# EAGLE design home_info_center_esp12f (EAGLE 8.7.1)
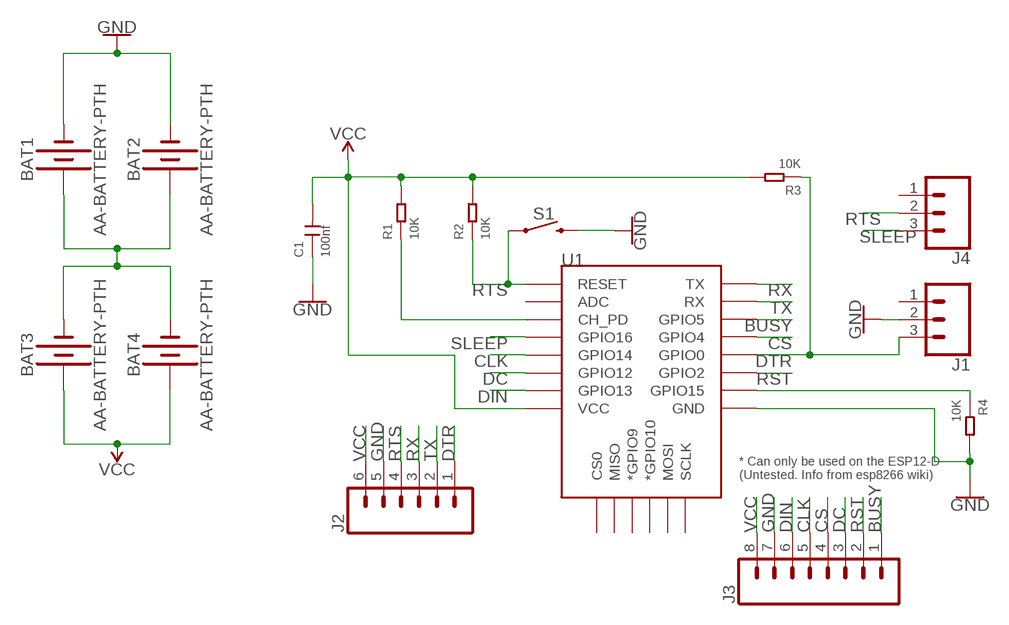
[diagram p0: schematic, sheet 1]

## Parts
BAT1  AA-BATTERY-PTH  [AA-PCB-BATTERY]
BAT2  AA-BATTERY-PTH  [AA-PCB-BATTERY]
BAT3  AA-BATTERY-PTH  [AA-PCB-BATTERY]
BAT4  AA-BATTERY-PTH  [AA-PCB-BATTERY]
C1  100nf  DIP-CERAMIC-DISC-100NF-50V-Y5V(D5.0MM)  [CERAMIC-2.54]
J1  CONN_03  [1X03]
J2  CONN_06LOCK  [1X06_LOCK]
J3  CONN_08LOCK  [1X08_LOCK]
J4  CONN_03  [1X03]
R1  10K  DIP-RES-10K-5%-1/4W(PR-D2.3XL6.5MM)  [PR-D2.3XL6.5MM]
R2  10K  DIP-RES-10K-5%-1/4W(PR-D2.3XL6.5MM)  [PR-D2.3XL6.5MM]
R3  10K  DIP-RES-10K-5%-1/4W(PR-D2.3XL6.5MM)  [PR-D2.3XL6.5MM]
R4  10K  DIP-RES-10K-5%-1/4W(PR-D2.3XL6.5MM)  [PR-D2.3XL6.5MM]
S1  MOMENTARY-SWITCH-SPST-PTH-6.0MM-KIT  [TACTILE_SWITCH_PTH_6.0MM_KIT]
U1  ESP12ESMD  [ESP12E-SMD]

## Nets
BUSY: J3.1 U1.GPIO5
CLK: J3.5 U1.GPIO14
CS: J3.4 U1.GPIO4
DC: J3.3 U1.GPIO12
DIN: J3.6 U1.GPIO13
DTR: J1.3 J2.1 R3.1 U1.GPIO0
GND: BAT1.NEG(-) BAT2.NEG(-) C1.1 J1.2 J2.5 J3.7 R4.2 S1.3 U1.GND
N$2: R1.1 U1.CH_PD
N$3: R4.1 U1.GPIO15
N$4: BAT1.POS(+) BAT2.POS(+) BAT3.NEG(-) BAT4.NEG(-)
RST: J3.2 U1.GPIO2
RTS: J2.4 J4.2 R2.1 S1.1 U1.RESET
RX: J2.3 U1.TXD0(TX)
SLEEP: J4.3 U1.GPIO16
TX: J2.2 U1.RXD0(RX)
VCC: BAT3.POS(+) BAT4.POS(+) C1.2 J2.6 J3.8 R1.2 R2.2 R3.2 U1.VCC
Unconnected: J1.1 J4.1 U1.ADC U1.CS0 U1.GPIO9(*GPIO9) U1.GPIO10(*GPIO10) U1.MISO U1.MOSI U1.SCLK

## Library data of the parts
BAT1-BAT4 = my-parts:AA-BATTERY-PTH: Package for a single AA battery holder (PTH)
C1 = Seeed-Capacitor:DIP-CERAMIC-DISC-100NF-50V-Y5V(D5.0MM): 302010208; MPN: CC1-F5SL2A101KSPW
J1 J4 = SparkFun-Connectors:CONN_03: Multi connection point. Often used as Generic Header-pin footprint for 0.1 inch spaced/style header connections On any of the 0.1 inch spaced packages, you can populate with these: Break Away Headers - Straight <https://www.sparkfun.com/products/116> (PRT-00116) Break Away Male Headers - Right Angle <https://www.sparkfun.com/products/553> (PRT-00553) Female Headers <https://www.sparkfun.com/products/115> (PRT-00115) Break Away Headers - Machine Pin <https://www.sparkfun.com/products/117> (PRT-00117) Break Away Female Headers - Swiss Machine Pin <https://www.sparkfun.com/products/743> (PRT-00743) Stackable Header - 3 Pin (Female, 0.1") <https://www.sparkfun.com/products/13875> (PRT-13875) For SCREWTERMINALS and SPRING TERMINALS visit here: Screw Terimnals on SparkFun.com <https://www.sparkfun.com/search/results?term=Screw+Terminals> (5mm/3.5mm/2.54mm spacing) This device is also useful as a general connection point to wire up your design to another part of your project. Our various solder wires solder well into these plated through hole pads. Hook-Up Wire - Assortment (Stranded, 22 AWG) <https://www.sparkfun.com/products/11375> (PRT-11375) Hook-Up Wire - Assortment (Solid Core, 22 AWG) <https://www.sparkfun.com/products/11367> (PRT-11367) View the entire wire category on our website here <https://www.sparkfun.com/categories/141> Special notes: Molex polarized connector foot print use with SKU : PRT-08232 with associated crimp pins and housings.
J2 = SparkFun-Connectors:CONN_06: Multi connection point. Often used as Generic Header-pin footprint for 0.1 inch spaced/style header connections On any of the 0.1 inch spaced packages, you can populate with these: Break Away Headers - Straight <https://www.sparkfun.com/products/116> (PRT-00116) Break Away Male Headers - Right Angle <https://www.sparkfun.com/products/553> (PRT-00553) Female Headers <https://www.sparkfun.com/products/115> (PRT-00115) Break Away Headers - Machine Pin <https://www.sparkfun.com/products/117> (PRT-00117) Break Away Female Headers - Swiss Machine Pin <https://www.sparkfun.com/products/743> (PRT-00743) Arduino Stackable Header - 6 Pin <https://www.sparkfun.com/products/9280> (PRT-09280) For SCREWTERMINALS and SPRING TERMINALS visit here: Screw Terimnals on SparkFun.com <https://www.sparkfun.com/search/results?term=Screw+Terminals> (5mm/3.5mm/2.54mm spacing) This device is also useful as a general connection point to wire up your design to another part of your project. Our various solder wires solder well into these plated through hole pads. Hook-Up Wire - Assortment (Stranded, 22 AWG) <https://www.sparkfun.com/products/11375> (PRT-11375) Hook-Up Wire - Assortment (Solid Core, 22 AWG) <https://www.sparkfun.com/products/11367> (PRT-11367) View the entire wire category on our website here <https://www.sparkfun.com/categories/141>
J3 = SparkFun-Connectors:CONN_08: Multi connection point. Often used as Generic Header-pin footprint for 0.1 inch spaced/style header connections On any of the 0.1 inch spaced packages, you can populate with these: Break Away Headers - Straight <https://www.sparkfun.com/products/116> (PRT-00116) Break Away Male Headers - Right Angle <https://www.sparkfun.com/products/553> (PRT-00553) Female Headers <https://www.sparkfun.com/products/115> (PRT-00115) Break Away Headers - Machine Pin <https://www.sparkfun.com/products/117> (PRT-00117) Break Away Female Headers - Swiss Machine Pin <https://www.sparkfun.com/products/743> (PRT-00743) Arduino Stackable Header - 8 Pin <https://www.sparkfun.com/products/9279> (PRT-09279) For SCREWTERMINALS and SPRING TERMINALS visit here: Screw Terimnals on SparkFun.com <https://www.sparkfun.com/search/results?term=Screw+Terminals> (5mm/3.5mm/2.54mm spacing) This device is also useful as a general connection point to wire up your design to another part of your project. Our various solder wires solder well into these plated through hole pads. Hook-Up Wire - Assortment (Stranded, 22 AWG) <https://www.sparkfun.com/products/11375> (PRT-11375) Hook-Up Wire - Assortment (Solid Core, 22 AWG) <https://www.sparkfun.com/products/11367> (PRT-11367) View the entire wire category on our website here <https://www.sparkfun.com/categories/141> Special notes: Molex polarized connector foot print use with SKU : PRT-08231 with associated crimp pins and housings. 1MM SMD Version SKU: PRT-10208 NOTES ON THE VARIANTS LOCK and LOCK_LONGPADS... This footprint was designed to help hold the alignment of a through-hole component (i.e. 6-pin header) while soldering it into place. You may notice that each hole has been shifted either up or down by 0.005 of an inch from it's more standard position (which is a perfectly straight line). This slight alteration caused the pins (the squares in the middle) to touch the edges of the holes. Because they are alternating, it causes a "brace" to hold the component in place. 0.005 has proven to be the perfect amount of "off-center" position when using our standard breakaway headers. Although looks a little odd when you look at the bare footprint, once you have a header in there, the alteration is very hard to notice. Also,if you push a header all the way into place, it is covered up entirely on the bottom side.
R1-R4 = Seeed-Resistor:DIP-RES-10K-5%-1/4W(PR-D2.3XL6.5MM): 301020001; MPN: FHCFR-1/4W-103J
S1 = SparkFun-Switches:MOMENTARY-SWITCH-SPST: Momentary Switch (Pushbutton) - SPST Normally-open (NO) SPST momentary switches (buttons, pushbuttons). Variants PTH-12MM - 12mm square, through-hole Momentary Pushbutton Switch - 12mm Square <https://www.sparkfun.com/products/9190> (COM-09190) PTH-6.0MM, PTH-6.0MM-KIT - 6.0mm square, through-hole Mini Pushbutton Switch <https://www.sparkfun.com/products/97> (COM-00097) KIT package intended for soldering kit's - only one side of pads' copper is exposed. PTH-RIGHT-ANGLE-KIT - Right-angle, through-hole Right Angle Tactile Button <https://www.sparkfun.com/products/10791> - Used on SparkFun BigTime Watch Kit <https://www.sparkfun.com/products/11734> SMD-12MM - 12mm square, surface-mount Tactile Button - SMD (12mm) <https://www.sparkfun.com/products/12993> (COM-12993) Used on SparkFun PicoBoard <https://www.sparkfun.com/products/11888> SMD-4.5MM - 4.5mm Square Trackball Switch Used on SparkFun Blackberry Trackballer Breakout <https://www.sparkfun.com/products/13169> SMD-4.6MMX2.8MM - 4.60mm x 2.80mm, surface mount Used on SparkFun SAMD21 Mini Breakout <https://www.sparkfun.com/products/13664> SMD-5.2MM, SMD-5.2-REDUNDANT - 5.2mm square, surface-mount Mini Pushbutton Switch - SMD <https://www.sparkfun.com/products/8720> (COM-08720) Used on Arduino Pro Mini <https://www.sparkfun.com/products/11114> REDUNDANT package connects both switch circuits together SMD-6.0X3.5MM - 6.0 x 3.5mm, surface mount Momentary Reset Switch SMD <https://www.sparkfun.com/products/8229> (COM-08229) SMD-6.2MM-TALL - 6.2mm square, surface mount Tactile Button - SMD (6mm) <https://www.sparkfun.com/products/12992> Used on SparkFun Digital Sandbox <https://www.sparkfun.com/products/12651> SMD-RIGHT-ANGLE - Right-angle, surface mount Used on SparkFun Block for Intel® Edison - Arduino <https://www.sparkfun.com/products/13036>; PROD_ID: SWCH-08441; SF_SKU: COM-00097
U1 = esp8266modules:ESP12E: ESP12E Module

## Board
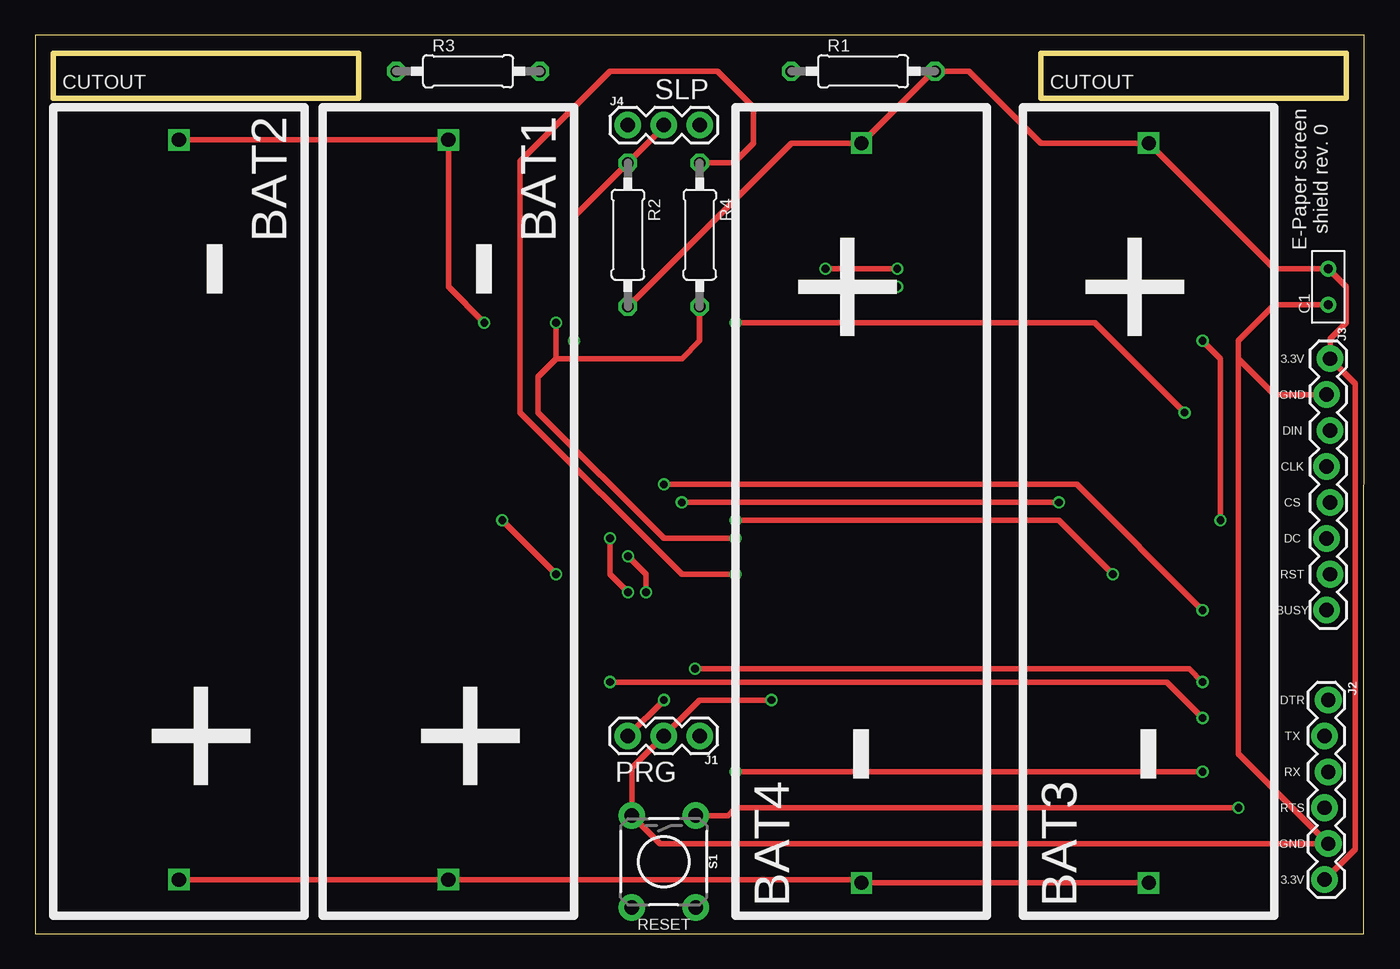
[diagram p1: board, top side]
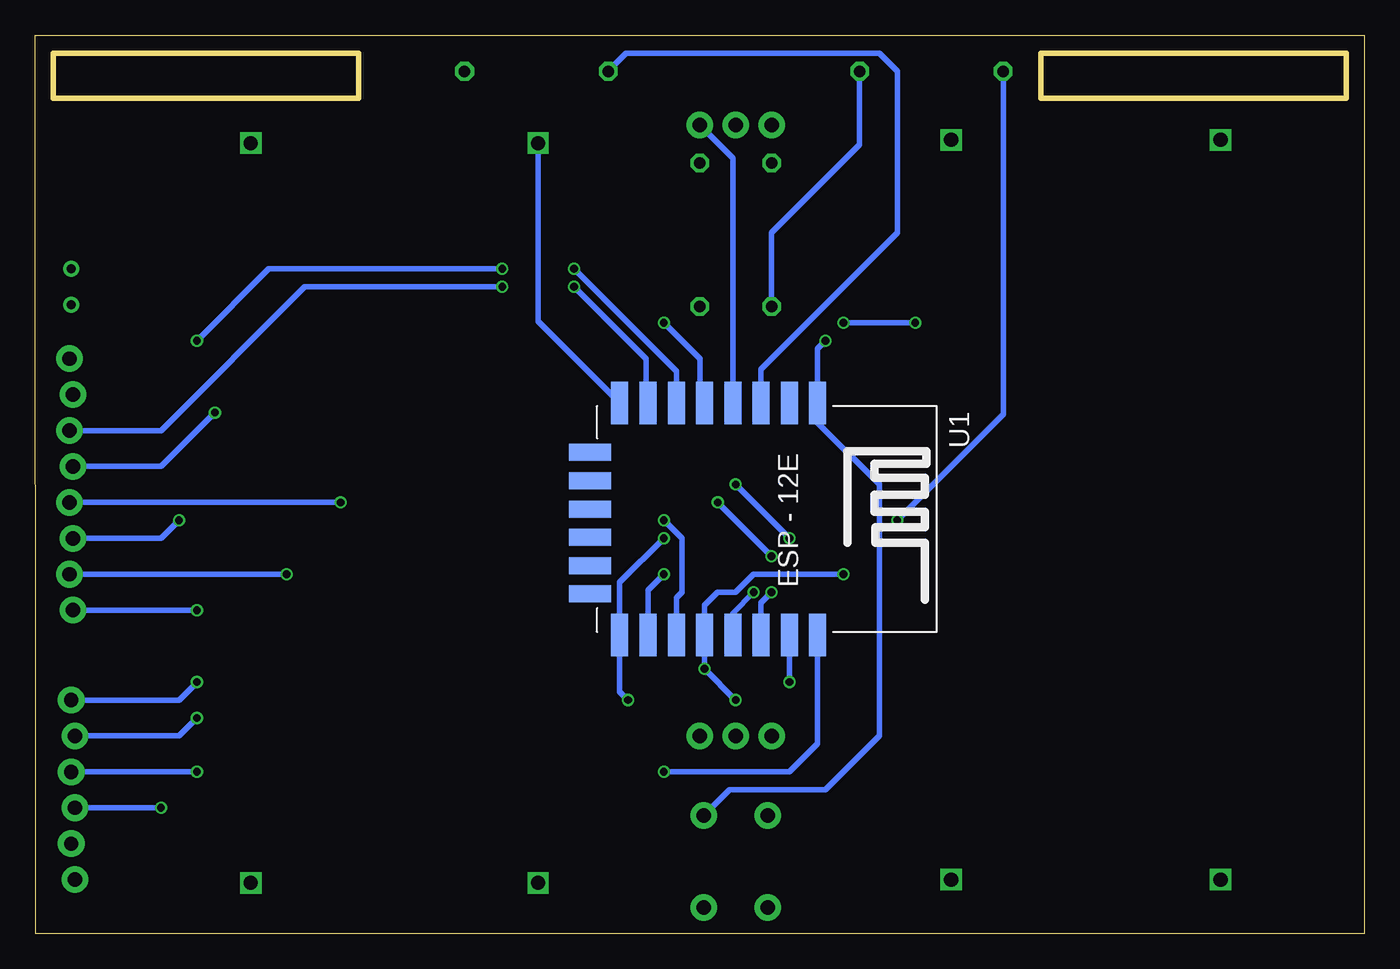
[diagram p2: board, bottom side, seen from below]

Size 93.98 x 63.5 mm. Coordinates in mm from the lower left corner, seen from the top.
Outline: 0,0 93.96,0 93.98,63.5 0,63.5 0,0
Outline: 1.27,62.23 22.86,62.23 22.86,59.05 1.27,59.05 1.27,62.23
Outline: 71.12,62.23 92.71,62.23 92.71,59.05 71.12,59.05 71.12,62.23
Copper layers (1*16): Top 0.035mm / dielectric 1.5mm / Bottom 0.035mm
Design rules "SeeedStudio_2layer_DRU_edited": minimum track width 7mil, minimum drill 15mil, track to track 6mil, track to pad 6mil, pad to pad 6mil, via to via 6mil, smd to smd 0mil, copper to edge 10mil, drill to drill 10mil, minimum pad ring 10mil, minimum via ring 6mil, stop-mask expansion 2mil, vias tented up to drill 100mil, thermal gap 10mil
Milling: 8 lines

### Footprints (pad centres in the part's own frame; a part is rotated, then mirrored left to right if it is on the bottom)
AA-PCB-BATTERY = drill 1 square: NEG -52.3,0; POS 0,0
CERAMIC-2.54 = drill 0.635 pad 1.143: 1 -1.27,0; 2 1.27,0
1X03 = drill 1.016 pad 1.88: 1 0,0; 2 2.54,0; 3 5.08,0
1X06_LOCK = drill 1.016 pad 1.88: 1 0,0; 2 2.54,-0.254; 3 5.08,0; 4 7.62,-0.254; 5 10.16,0; 6 12.7,-0.254
1X08_LOCK = drill 1.016 pad 1.88: 1 0,0.127; 2 2.54,-0.127; 3 5.08,0.127; 4 7.62,-0.127; 5 10.16,0.127; 6 12.7,-0.127; 7 15.24,0.127; 8 17.78,-0.127
PR-D2.3XL6.5MM = drill 0.813 octagon: 1 -4.953,0; 2 5.207,0
TACTILE_SWITCH_PTH_6.0MM_KIT = drill 1.016 pad 1.88: 1 -3.251,2.261; 2 3.251,2.261; 3 -3.251,-2.261; 4 3.251,-2.261
ESP12E-SMD = smd 3 x 1.2: ADC -8.3,3.8; CH_PD -8.3,1.8; GND 8.1,-8.2; GPIO0 8.1,-2.2; GPIO2 8.1,-4.2; GPIO4 8.1,-0.2; GPIO5 8.1,1.8; GPIO12 -8.3,-4.2; GPIO13 -8.3,-6.2; GPIO14 -8.3,-2.2; GPIO15 8.1,-6.2; GPIO16 -8.3,-0.2; RESET -8.3,5.8; RXD0 8.1,3.8; TXD0 8.1,5.8; VCC -8.3,-8.2 | smd 1.2 x 3: CS0 -4.8,-10.3; GPIO9 -0.8,-10.3; GPIO10 1.2,-10.3; MISO -2.8,-10.3; MOSI 3.2,-10.3; SCLK 5.2,-10.3

### Placement (x,y rotation side)
BAT1  29.21,3.81 270 top
BAT2  10.16,3.81 270 top
BAT3  78.74,55.88 90 top
BAT4  58.42,55.88 90 top
C1  91.44,45.72 90 top
J1  46.99,13.97 180 top
J2  91.44,16.51 270 top
J3  91.44,22.86 90 top
J4  41.91,57.15 0 top
R1  58.42,60.96 0 top
R2  41.91,49.53 270 top
R3  30.48,60.96 0 top
R4  46.99,49.53 270 top
S1  44.45,5.08 270 top
U1  44.45,29.21 270 bottom

### Tracks (layer width: path | path; a pad name or v marks a point on that pad's centre or on a via)
BUSY  (via drill 0.55)
  Top 0.406: v41.91,24.13 40.64,25.4 v40.64,27.94 | v44.45,31.75 73.66,31.75 v82.55,22.86
  Bottom 0.406: U1.GPIO5 42.65,23.39 v41.91,24.13 | v40.64,27.94 v44.45,31.75 | v82.55,22.86 J3.1
CLK  (via drill 0.55)
  Top 0.406: v49.53,43.18 74.93,43.18 v81.28,36.83
  Bottom 0.406: U1.GPIO14 46.99,37.85 46.99,40.64 v49.53,43.18 | v81.28,36.83 85.09,33.02 J3.5 91.44,33.02
CS  (via drill 0.55)
  Top 0.406: v43.18,24.13 43.18,25.4 v41.91,26.67 | v45.72,30.48 v72.39,30.48
  Bottom 0.406: U1.GPIO4 44.65,22.66 v43.18,24.13 | v41.91,26.67 v45.72,30.48 | v72.39,30.48 J3.4
DC  (via drill 0.55)
  Top 0.406: v55.88,46.99 v60.96,46.99 | v82.55,41.91 83.82,40.64 v83.82,29.21
  Bottom 0.406: U1.GPIO12 48.65,39.76 v55.88,46.99 | v60.96,46.99 77.47,46.99 v82.55,41.91 | v83.82,29.21 85.09,27.94 J3.3
DIN  (via drill 0.55)
  Top 0.406: v55.88,45.72 v60.96,45.72
  Bottom 0.406: U1.GPIO13 50.8,37.66 50.8,40.64 v55.88,45.72 | v60.96,45.72 74.93,45.72 85.09,35.56 J3.6
DTR  (via drill 0.55)
  Top 0.406: J1.3 v44.45,16.51 | v46.65,18.71 81.62,18.71 v82.55,17.78 | v33.02,29.21 v36.83,25.4
  Bottom 0.406: v44.45,16.51 v46.65,18.71 U1.GPIO0 46.65,23.2 45.72,24.13 44.45,24.13 43.18,25.4 v36.83,25.4 | v82.55,17.78 83.82,16.51 J2.1 | R3.1 25.53,36.7 v33.02,29.21
GND  (via drill 0.55)
  Top 0.406: C1.1 87.63,44.45 85.09,41.91 85.09,40.64 | 85.09,40.64 87.63,38.1 J3.7 | BAT2.NEG BAT1.NEG 29.21,45.72 v31.75,43.18 | 85.09,40.64 85.09,12.7 J2.5 44.17,6.35 S1.3 42.19,11.71 J1.2 46.99,16.51 v52.07,16.51 | R4.2 46.99,41.91 45.72,40.64 36.83,40.64 | 36.83,40.64 35.56,39.37 35.56,36.83 44.45,27.94 v49.53,27.94 | v36.83,43.18 36.83,40.64
  Bottom 0.406: v52.07,16.51 52.65,17.09 U1.GND 52.65,24.82 v49.53,27.94 | v31.75,43.18 v36.83,43.18
N$2
  Bottom 0.406: R1.1 52.2,62.23 34.29,62.23 33.02,60.96 33.02,49.53 42.65,39.9 U1.CH_PD
N$3  (via drill 0.55)
  Top 0.406: R4.1 49.4,54.48 50.8,55.88 50.8,58.42 48.26,60.96 40.64,60.96 34.29,54.61 34.29,36.83 45.72,25.4 v49.53,25.4
  Bottom 0.406: v49.53,25.4 50.65,24.28 U1.GPIO15
N$4
  Top 0.406: BAT2.POS BAT1.POS 58.19,3.81 BAT4.NEG BAT3.NEG
RST  (via drill 0.55)
  Top 0.406: v49.53,29.21 72.39,29.21 v76.2,25.4
  Bottom 0.406: U1.GPIO2 48.65,23.74 48.26,24.13 48.26,27.94 v49.53,29.21 | v76.2,25.4 J3.2
RTS  (via drill 0.55)
  Top 0.406: S1.1 48.97,8.33 49.53,8.89 v85.09,8.89 | v38.1,41.91 38.1,50.67 R2.1 44.45,57.02 J4.2
  Bottom 0.406: v85.09,8.89 J2.4 | S1.1 44.88,10.16 38.1,10.16 34.29,13.97 34.29,31.75 38.65,36.11 U1.RESET 38.65,41.36 v38.1,41.91
RX  (via drill 0.55)
  Top 0.406: v49.53,11.43 v82.55,11.43
  Bottom 0.406: U1.TXD0 38.65,13.42 40.64,11.43 v49.53,11.43 | v82.55,11.43 J2.3
SLEEP
  Bottom 0.406: U1.GPIO16 44.65,54.81 J4.3
TX  (via drill 0.55)
  Top 0.406: v82.55,15.24 80.01,17.78 v40.64,17.78
  Bottom 0.406: U1.RXD0 v40.65,17.79 v40.64,17.78 | v82.55,15.24 83.82,13.97 J2.2
VCC
  Top 0.406: J2.6 93.34,5.97 93.34,38.86 J3.8 91.57,42.04 92.71,43.18 92.71,45.72 C1.2 87.63,46.99 BAT3.POS 71.12,55.88 66.04,60.96 R1.2 63.5,60.96 BAT4.POS 53.47,55.88 R2.2
  Bottom 0.406: U1.VCC 58.42,43.28 BAT4.POS | R3.2 35.69,55.75 41.91,49.53 R2.2

### Text on the board
tPlace: CUTOUT | SLP | CUTOUT | E-Paper screen / shield rev. 0 | 3.3V | GND | DIN | CLK | CS | DC | RST | BUSY | DTR | TX | PRG | RX | RTS | GND | 3.3V | RESET